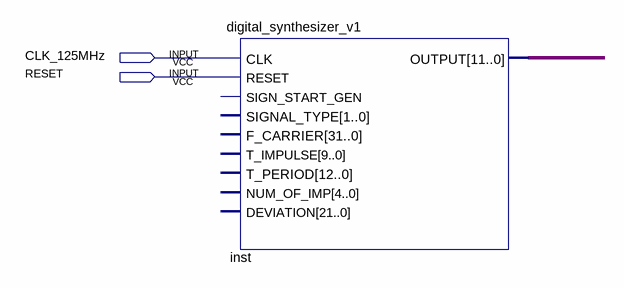
[diagram p0: schematic sheet]
// Quartus schematic digital_synthesizer_v1_2.bdf as structural Verilog: 1 symbols, 2 pins
module digital_synthesizer_v1_2 (
  input  CLK_125MHz,
  input  RESET
);

  wire [11:0] inst_output;

  digital_synthesizer_v1 inst (
    .CLK(CLK_125MHz), .RESET(RESET), .OUTPUT(inst_output));  // open: SIGN_START_GEN, SIGNAL_TYPE, F_CARRIER, T_IMPULSE, T_PERIOD, NUM_OF_IMP, DEVIATION
endmodule
